# EAGLE schematic schematic_ap_copy (EAGLE 7.7.0)
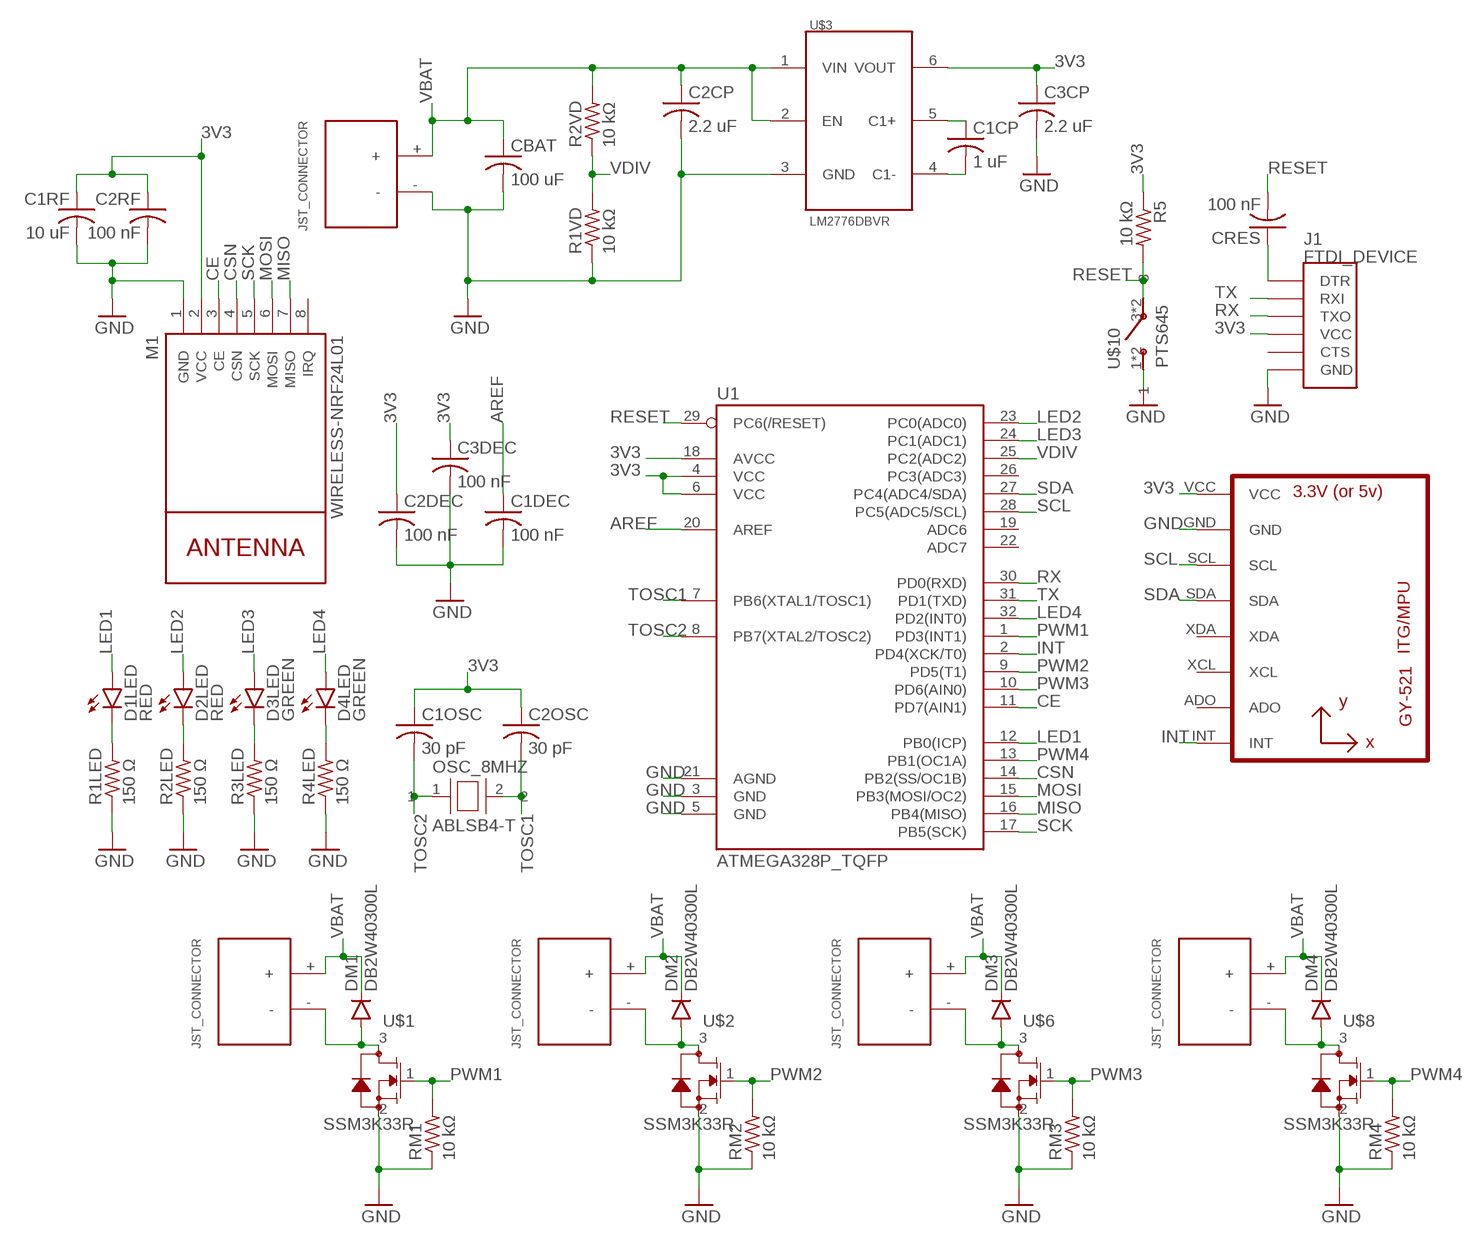
[diagram p0: schematic, sheet 1]

## Parts
C1CP  1 uF  C-USC0603  [C0603]
C1DEC  100 nF  C-USC0603  [C0603]
C1OSC  30 pF  C-USC0603  [C0603]
C1RF  10 uF  C-USC0603  [C0603]
C2CP  2.2 uF  C-USC0603  [C0603]
C2DEC  100 nF  C-USC0603  [C0603]
C2OSC  30 pF  C-USC0603  [C0603]
C2RF  100 nF  C-USC0603  [C0603]
C3CP  2.2 uF  C-USC0603  [C0603]
C3DEC  100 nF  C-USC0603  [C0603]
CBAT  100 uF  C-USC0805  [C0805]
CRES  100 nF  C-USC0603  [C0603]
D1LED  RED  LED-RED0603  [LED-0603]
D2LED  RED  LED-RED0603  [LED-0603]
D3LED  GREEN  LED-GREEN0603  [LED-0603]
D4LED  GREEN  LED-GREEN0603  [LED-0603]
DM1  DB2W40300L  [MINI2-F3-B]
DM2  DB2W40300L  [MINI2-F3-B]
DM3  DB2W40300L  [MINI2-F3-B]
DM4  DB2W40300L  [MINI2-F3-B]
J1  FTDI_DEVICE  [FTDI_DEVICE_SIDE]
M1  WIRELESS-NRF24L01  [WIRELESS-NRF24L01]
OSC_8MHZ  ABLSB4-T  [SOT-23]
R1LED  150 Ω  R-US_R0603  [R0603]
R1VD  10 kΩ  R-US_R0603  [R0603]
R2LED  150 Ω  R-US_R0603  [R0603]
R2VD  10 kΩ  R-US_R0603  [R0603]
R3LED  150 Ω  R-US_R0603  [R0603]
R4LED  150 Ω  R-US_R0603  [R0603]
R5  10 kΩ  R-US_R0603  [R0603]
RM1  10 kΩ  R-US_R0603  [R0603]
RM2  10 kΩ  R-US_R0603  [R0603]
RM3  10 kΩ  R-US_R0603  [R0603]
RM4  10 kΩ  R-US_R0603  [R0603]
U1  ATMEGA328P_TQFP  [TQFP32-08]
U2  GY-521MPU6050  [GY-521]
U$1  SSM3K33R  [SOT-23F]
U$2  SSM3K33R  [SOT-23F]
U$3  LM2776DBVR  [SOT23-5]
U$4  JST_CONNECTOR_FEMALE  [JST_CONNECTOR_FEMALE]
U$5  JST_CONNECTOR_FEMALE  [JST_CONNECTOR_FEMALE]
U$6  SSM3K33R  [SOT-23F]
U$7  JST_CONNECTOR_FEMALE  [JST_CONNECTOR_FEMALE]
U$8  SSM3K33R  [SOT-23F]
U$9  JST_CONNECTOR_FEMALE  [JST_CONNECTOR_FEMALE]
U$10  PTS645  [SOT-35]
U$11  JST_CONNECTOR_FEMALE  [JST_CONNECTOR_FEMALE]

## Nets
3V3: C1OSC.1 C1RF.1 C2DEC.1 C2OSC.1 C2RF.1 C3CP.1 C3DEC.1 J1.P$4(VCC) M1.2(VCC) R5.1 U1.4(VCC) U1.6(VCC) U1.18(AVCC) U2.VCC U$3.6(VOUT)
AREF: C1DEC.1 U1.20(AREF)
CE: M1.3(CE) U1.11(PD7(AIN1))
CSN: M1.4(CSN) U1.14(PB2(SS/OC1B))
GND: C1DEC.2 C1RF.2 C2CP.2 C2DEC.2 C2RF.2 C3CP.2 C3DEC.2 CBAT.2 J1.P$6(GND) M1.1(GND) R1LED.1 R1VD.1 R2LED.1 R3LED.1 R4LED.1 RM1.1 RM2.1 RM3.1 RM4.1 U1.3(GND) U1.5(GND) U1.21(AGND) U2.GND U$1.2 U$2.2 U$3.3(GND) U$6.2 U$8.2 U$10.1 U$10.2 U$11.-
INT: U1.2(PD4(XCK/T0)) U2.INT
LED1: D1LED.A U1.12(PB0(ICP))
LED2: D2LED.A U1.23(PC0(ADC0))
LED3: D3LED.A U1.24(PC1(ADC1))
LED4: D4LED.A U1.32(PD2(INT0))
MISO: M1.7(MISO) U1.16(PB4(MISO))
MOSI: M1.6(MOSI) U1.15(PB3(MOSI/OC2))
N$3: CRES.1 J1.P$1(DTR)
N$12: C1CP.1 U$3.5(C1+)
N$13: C1CP.2 U$3.4(C1-)
N$15: DM1.POS(PPIN) U$1.3 U$4.-
N$19: D4LED.C R4LED.2
N$20: DM2.POS(PPIN) U$2.3 U$5.-
N$21: D2LED.C R2LED.2
N$23: D3LED.C R3LED.2
N$24: DM3.POS(PPIN) U$6.3 U$7.-
N$26: DM4.POS(PPIN) U$8.3 U$9.-
N$30: D1LED.C R1LED.2
PWM1: RM1.2 U1.1(PD3(INT1)) U$1.1
PWM2: RM2.2 U1.9(PD5(T1)) U$2.1
PWM3: RM3.2 U1.10(PD6(AIN0)) U$6.1
PWM4: RM4.2 U1.13(PB1(OC1A)) U$8.1
RESET: CRES.2 R5.2 U1.29(PC6(/RESET)) U$10.3 U$10.4
RX: J1.P$3(TXO) U1.30(PD0(RXD))
SCK: M1.5(SCK) U1.17(PB5(SCK))
SCL: U1.28(PC5(ADC5/SCL)) U2.SCL
SDA: U1.27(PC4(ADC4/SDA)) U2.SDA
TOSC1: C2OSC.2 OSC_8MHZ.2 U1.7(PB6(XTAL1/TOSC1))
TOSC2: C1OSC.2 OSC_8MHZ.1 U1.8(PB7(XTAL2/TOSC2))
TX: J1.P$2(RXI) U1.31(PD1(TXD))
VBAT: C2CP.1 CBAT.1 DM1.NEG(GPIN) DM2.NEG(GPIN) DM3.NEG(GPIN) DM4.NEG(GPIN) R2VD.2 U$3.1(VIN) U$3.2(EN) U$4.+ U$5.+ U$7.+ U$9.+ U$11.+
VDIV: R1VD.2 R2VD.1 U1.25(PC2(ADC2))
Unconnected: J1.P$5(CTS) M1.8(IRQ) U1.19(ADC6) U1.22(ADC7) U1.26(PC3(ADC3)) U2.ADO U2.XCL U2.XDA

## Library data of the parts
C1CP C1DEC C1OSC C1RF C2CP C2DEC C2OSC C2RF C3CP C3DEC CBAT CRES = rcl:C-US: CAPACITOR, American symbol; SPICEPREFIX: C
D1LED D2LED = LEDs:LED-RED: Assorted Red LEDs LilyPad 1206- DIO-09912 1206- DIO-00809 0603- DIO-00819 "SMART" means more efficient and expensive; PROD_ID: DIO-00819
D3LED D4LED = LEDs:LED-GREEN: Various green LEDs Green LEDs used in SFE Production 0603- DIO-00821 LARGE- DIO-00862 LILYPAD- DIO-09910; PROD_ID: DIO-00821
DM1-DM4 = quad:DB2W40300L
J1 = quad:FTDI_DEVICE: Connector which mates to FTDI basic or FTDI cable.
M1 = quad:WIRELESS-NRF24L01: 2.4 GHz Wireless Module based on NRF24L01 chip
OSC_8MHZ = ABLS_B4_T:ABLS
R1LED R1VD R2LED R2VD R3LED R4LED R5 RM1-RM4 = resistor:R-US_: RESISTOR, American symbol
U1 = quad:ATMEGA328P_TQFP; PROD_ID: IC-09069
U2 = quad:GY-521
U$1 U$2 U$6 U$8 = SSM3K33R:SSM3K33R
U$3 = LM2776:LM2776
U$4 U$5 U$7 U$9 U$11 = quad:JST_CONNECTOR_FEMALE
U$10 = PTS645:PTS645